# EAGLE design FED3_041319 (EAGLE 9.3.0)
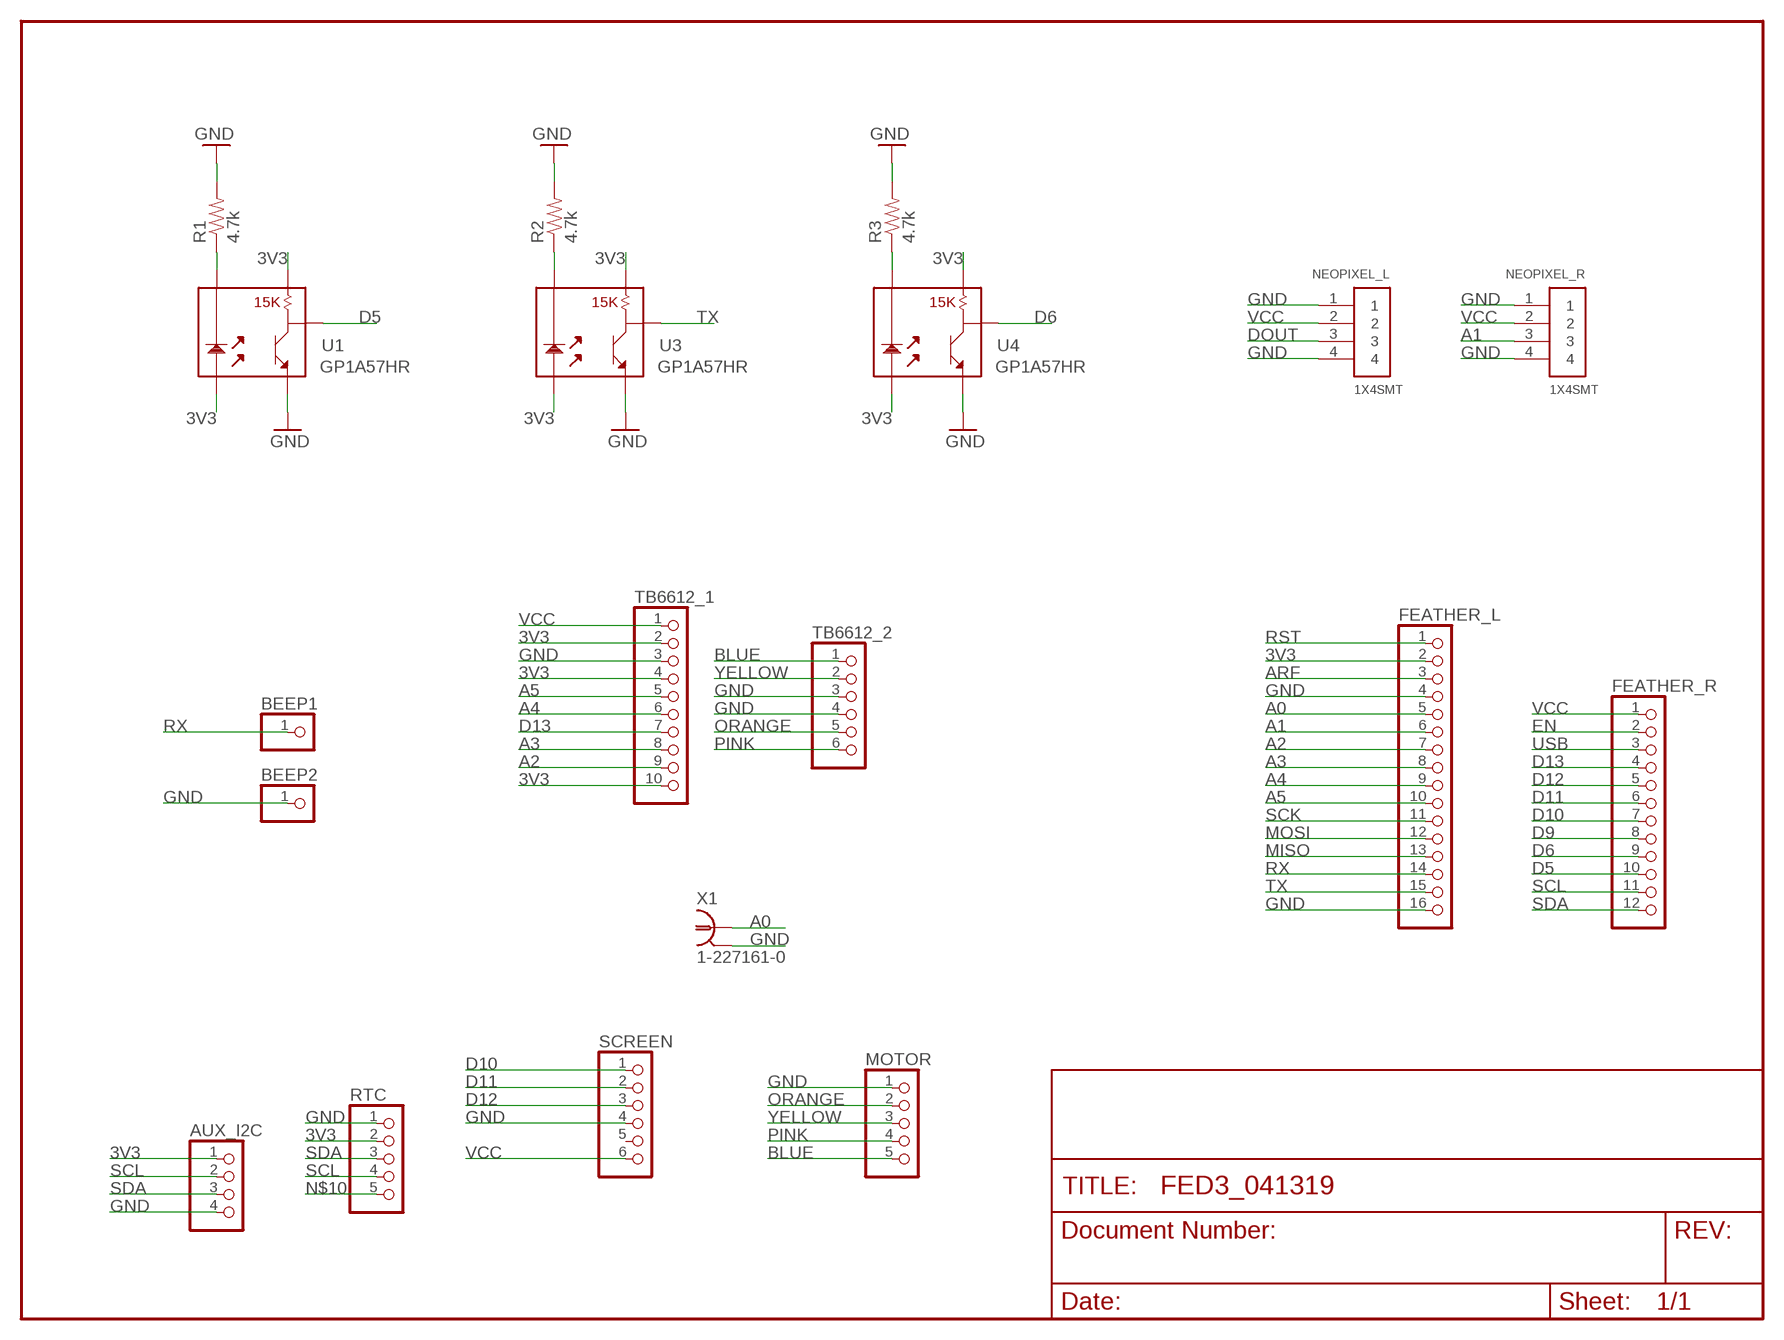
[diagram p0: schematic, sheet 1]

## Parts
AUX_I2C  PINHD-1X4  [1X04]
BEEP1  PINHD-1X1  [1X01]
BEEP2  PINHD-1X1  [1X01]
FEATHER_L  PINHD-1X16  [1X16]
FEATHER_R  PINHD-1X12  [1X12]
MOTOR  PINHD-1X5  [1X05]
NEOPIXEL_L  1X4SMT  [1X4-SMT]
NEOPIXEL_R  1X4SMT  [1X4-SMT]
R1  4.7k  RESISTORPTH1  [AXIAL-0.3]
R2  4.7k  RESISTORPTH1  [AXIAL-0.3]
R3  4.7k  RESISTORPTH1  [AXIAL-0.3]
RTC  PINHD-1X5  [1X05]
SCREEN  PINHD-1X6  [1X06]
TB6612_1  PINHD-1X10  [1X10]
TB6612_2  PINHD-1X6  [1X06]
U1  GP1A57HR  [GP1A57HR]
U3  GP1A57HR  [GP1A57HR]
U4  GP1A57HR  [GP1A57HR]
X1  1-227161-0  [AMP_227161]

## Nets
3V3: AUX_I2C.1 FEATHER_L.2 RTC.2 TB6612_1.2 TB6612_1.4 TB6612_1.10 U1.1 U1.3 U3.1 U3.3 U4.1 U4.3
A0: FEATHER_L.5 X1.1
A1: FEATHER_L.6 NEOPIXEL_R.3
A2: FEATHER_L.7 TB6612_1.9
A3: FEATHER_L.8 TB6612_1.8
A4: FEATHER_L.9 TB6612_1.6
A5: FEATHER_L.10 TB6612_1.5
ARF: FEATHER_L.3
BLUE: MOTOR.5 TB6612_2.1
D5: FEATHER_R.10 U1.4
D6: FEATHER_R.9 U4.4
D9: FEATHER_R.8
D10: FEATHER_R.7 SCREEN.1
D11: FEATHER_R.6 SCREEN.2
D12: FEATHER_R.5 SCREEN.3
D13: FEATHER_R.4 TB6612_1.7
DOUT: NEOPIXEL_L.3
EN: FEATHER_R.2
GND: AUX_I2C.4 BEEP2.1 FEATHER_L.4 FEATHER_L.16 MOTOR.1 NEOPIXEL_L.1 NEOPIXEL_L.4 NEOPIXEL_R.1 NEOPIXEL_R.4 R1.P$2 R2.P$2 R3.P$2 RTC.1 SCREEN.4 TB6612_1.3 TB6612_2.3 TB6612_2.4 U1.5 U3.5 U4.5 X1.2
MISO: FEATHER_L.13
MOSI: FEATHER_L.12
N$1: R2.P$1 U3.2
N$2: R1.P$1 U1.2
N$3: R3.P$1 U4.2
N$10: RTC.5
ORANGE: MOTOR.2 TB6612_2.5
PINK: MOTOR.4 TB6612_2.6
RST: FEATHER_L.1
RX: BEEP1.1 FEATHER_L.14
SCK: FEATHER_L.11
SCL: AUX_I2C.2 FEATHER_R.11 RTC.4
SDA: AUX_I2C.3 FEATHER_R.12 RTC.3
TX: FEATHER_L.15 U3.4
USB: FEATHER_R.3
VCC: FEATHER_R.1 NEOPIXEL_L.2 NEOPIXEL_R.2 SCREEN.6 TB6612_1.1
YELLOW: MOTOR.3 TB6612_2.2
Unconnected: SCREEN.5

## Library data of the parts
AUX_I2C = pinhead:PINHD-1X4: PIN HEADER
BEEP1 BEEP2 = pinhead:PINHD-1X1: PIN HEADER
FEATHER_L = pinhead:PINHD-1X16: PIN HEADER
FEATHER_R = pinhead:PINHD-1X12: PIN HEADER
MOTOR RTC = pinhead:PINHD-1X5: PIN HEADER
NEOPIXEL_L NEOPIXEL_R = adafruit:1X4: 4-pin connector
R1-R3 = SparkFun:RESISTOR: Resistor Basic schematic elements and footprints for 0603, 1206, and PTH 1/10th watt (small) resistors.
SCREEN TB6612_2 = pinhead:PINHD-1X6: PIN HEADER
TB6612_1 = pinhead:PINHD-1X10: PIN HEADER
U1 U3 U4 = SparkFun:GP1A57HR
X1 = con-coax:?227161*: JACK, RIGHT ANGLE, 50 OHM, PCB, BNC Source: amp_227161.pdf; MF: TYCO ELECTRONICS; MPN: 1-227161; OC_FARNELL: unknown; OC_NEWARK: 33B3200

## Board
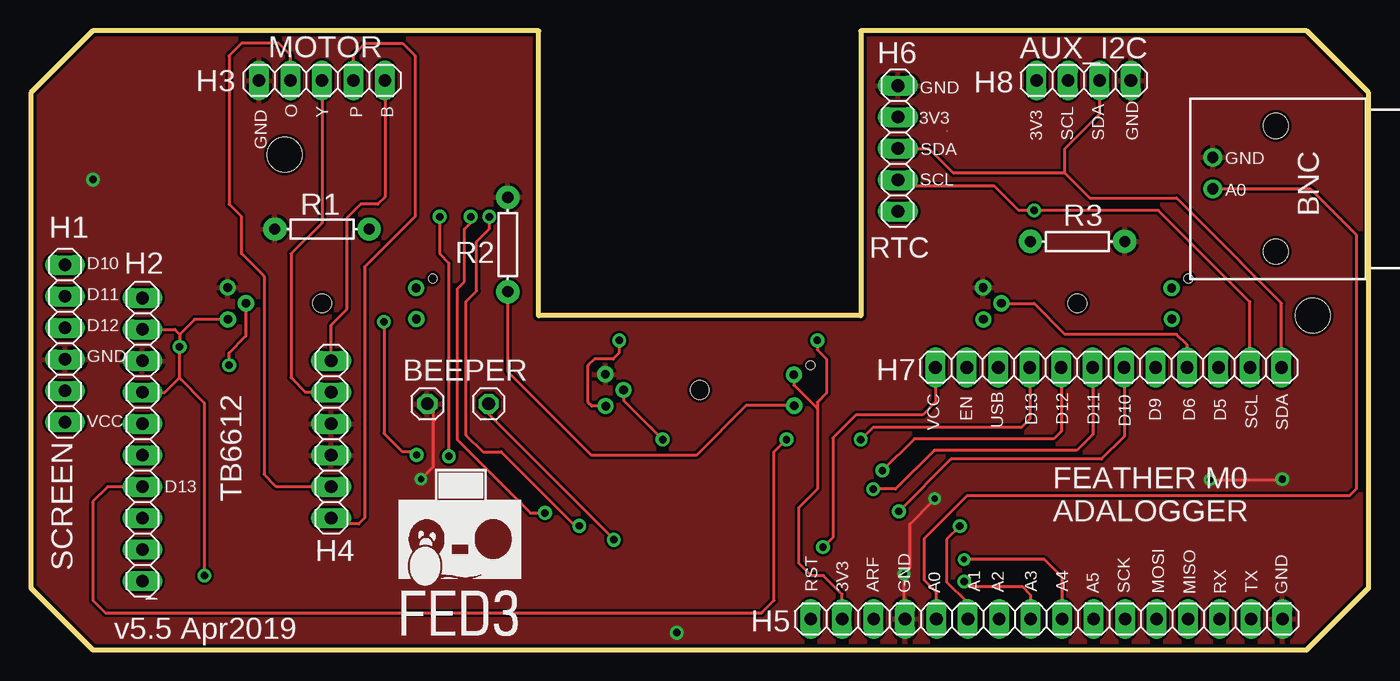
[diagram p1: board, top side]
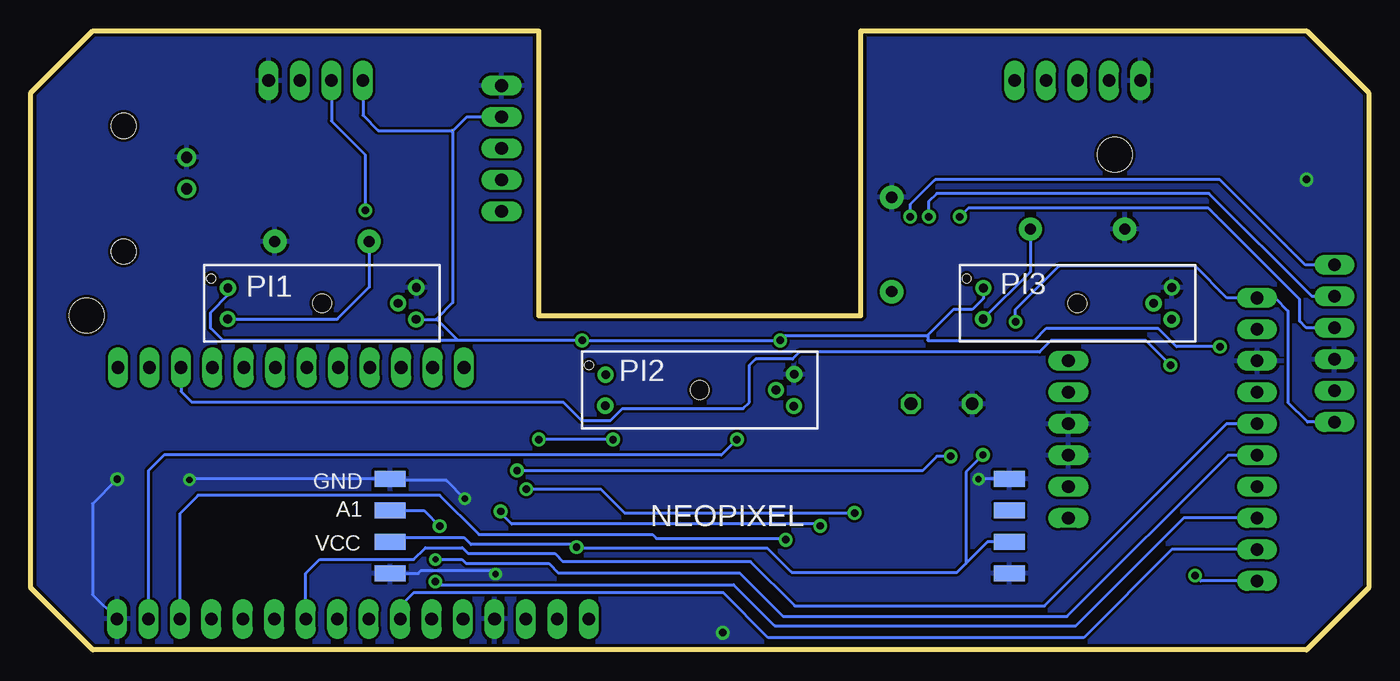
[diagram p2: board, bottom side, seen from below]

Size 108 x 50 mm. Coordinates in mm from the lower left corner, seen from the top.
Outline: 0,45 0,5 5,0 103,0 108,5 108,45 103,50 67,50 67,27 41,27 41,50 5,50 0,45
Copper layers (1*16): Top 0.0356mm / dielectric 1.5011mm / Bottom 0.0356mm
Design rules "default": minimum track width 8mil, minimum drill 20mil, track to track 8mil, track to pad 8mil, pad to pad 8mil, via to via 8mil, smd to smd 8mil, copper to edge 10mil, drill to drill 8mil, minimum pad ring 12mil, minimum via ring 10mil, stop-mask expansion 4mil, vias tented up to drill 20mil, thermal gap 10mil
Holes 2.8 mm at 20.5,40 103.5,27

### Footprints (pad centres in the part's own frame; a part is rotated, then mirrored left to right if it is on the bottom)
1X04 = drill 1.016 long: 1 -3.81,0; 2 -1.27,0; 3 1.27,0; 4 3.81,0
1X01 = drill 1.016 octagon: 1 0,0
1X16 = drill 1.016 long: 1 -19.05,0; 2 -16.51,0; 3 -13.97,0; 4 -11.43,0; 5 -8.89,0; 6 -6.35,0; 7 -3.81,0; 8 -1.27,0; 9 1.27,0; 10 3.81,0; 11 6.35,0; 12 8.89,0; 13 11.43,0; 14 13.97,0; 15 16.51,0; 16 19.05,0
1X12 = drill 1.016 long: 1 -13.97,0; 2 -11.43,0; 3 -8.89,0; 4 -6.35,0; 5 -3.81,0; 6 -1.27,0; 7 1.27,0; 8 3.81,0; 9 6.35,0; 10 8.89,0; 11 11.43,0; 12 13.97,0
1X05 = drill 1.016 long: 1 -5.08,0; 2 -2.54,0; 3 0,0; 4 2.54,0; 5 5.08,0
1X4-SMT = smd 1.27 x 2.54: 1 -3.81,0; 2 -1.27,0; 3 1.27,0; 4 3.81,0
AXIAL-0.3 = drill 0.9 pad 1.88: P$1 -3.81,0; P$2 3.81,0
1X06 = drill 1.016 long: 1 -6.35,0; 2 -3.81,0; 3 -1.27,0; 4 1.27,0; 5 3.81,0; 6 6.35,0
1X10 = drill 1.016 long: 1 -11.43,0; 2 -8.89,0; 3 -6.35,0; 4 -3.81,0; 5 -1.27,0; 6 1.27,0; 7 3.81,0; 8 6.35,0; 9 8.89,0; 10 11.43,0
GP1A57HR = drill 0.7: 1 -7.6,1.24; 2 -7.62,-1.27; 3 7.6,-1.3; 4 6.15,0; 5 7.62,1.27 | hole 1.5: 0,0 | hole 0.7: -8.95,2
AMP_227161 = drill 0.9 pad 1.27: 1 0,-5.08; 2 -2.54,-5.08 | hole 2: -5.08,0; 5.08,0

### Placement (x,y rotation side)
AUX_I2C  85,46 0 top
BEEP1  36.95,19.88 0 top
BEEP2  32,19.88 0 top
FEATHER_L  82,2.5 0 top
FEATHER_R  87,22.82 0 top
MOTOR  23.5,46 0 top
NEOPIXEL_L  29,10 90 bottom
NEOPIXEL_R  79,10 90 bottom
R1  23.5,34 180 top
R2  38.5,32.75 90 top
R3  84.5,33 0 top
RTC  70,40.5 270 top
SCREEN  2.75,24.75 270 top
TB6612_1  9,17 270 top
TB6612_2  24.24,17 270 top
U1  23.5,28 0 bottom
U3  54,21 0 bottom
U4  84.5,28 0 bottom
X1  100.5,37.25 270 top

### Tracks (layer width: path | path; a pad name or v marks a point on that pad's centre or on a via)
3V3  (via drill 0.6, 0.6 pad 0.61)  (1 unrouted)
  Top 0.254: 12,22 12,21.96 14,19.96 v14,6 | 12,22 v12,24.5 12,25.5 | v47.5,25 47.5,24 47,23.5 45.5,23.5 45,23 45,20 45.3,19.7 U3.3 | 63.5,19.5 63.5,20 64.25,20.75 64.25,23.5 63.5,24.25 v63.5,25 | 63.5,19.5 63.5,13 62,11.5 62,7 63,6 64,6 65.49,4.51 FEATHER_L.2 | TB6612_1.4 10.81,20.81 12,22 | TB6612_1.2 11.61,25.89 12,25.5 | U1.3 13.2,26.7 12,25.5 | U3.1 61.6,21.4 63.5,19.5
  Bottom 0.254: 35.62,25.38 47.12,25.38 v47.5,25 v63.5,25 73.5,25 | 35.62,25.38 35.59,25.38 35.59,25 27,25 26,26 17,26 15.5,24.5 v12,24.5 | 35.62,25.38 33.5,27.5 32,27.5 31.1,28.4 U1.1 | U4.1 92.1,28.65 93.5,27.25 93.5,26 92.5,25 73.5,25 | TB6612_1.10 13.57,5.57 v14,6 | 73.95,41.96 73.95,28.05 75.3,26.7 | 75.3,26.7 75.2,26.7 73.5,25 | U4.3 75.3,26.7 | AUX_I2C.1 81.19,43.19 79.96,41.96 74,41.96 74,41.86 72.82,43.04 RTC.2
A0
  Top 0.254: X1.1 103.3,37.25 107,33.55 107,13 106.48,12.48 75.63,12.48 72.12,8.98 72.12,5.65 73.11,4.66 FEATHER_L.5
A1  (via drill 0.6)
  Top 0.254: v75,10 73.93,8.93 73.93,5.51 75.65,3.79 FEATHER_L.6
  Bottom 0.254: NEOPIXEL_R.3 76.27,11.27 v75,10
A2
  Bottom 0.254: TB6612_1.9 15.89,8.11 23,1 48.48,1 52.1,4.62 71.81,4.62 77.1,4.62 78.03,3.68 78.26,3.68 78.26,2.57 FEATHER_L.7
A3  (via drill 0.6)
  Top 0.254: v75.35,5.52 75.78,5.09 80.08,5.09 80.73,4.43 FEATHER_L.8
  Bottom 0.203: v75.35,5.52 75.35,5.3 75.38,5.27
  Bottom 0.254: 75.38,5.27 51.27,5.27 47.96,1.96 23.62,1.96 14.93,10.65 TB6612_1.8
A4  (via drill 0.51)
  Top 0.254: FEATHER_L.9 83.27,5.86 81.81,7.32 v75.34,7.32
  Bottom 0.254: TB6612_1.6 11.33,15.73 24.35,2.71 47.28,2.71 50.8,6.23 65.42,6.23 66.18,6.99 72.86,6.99 73.19,7.32 v75.34,7.32
A5
  Bottom 0.254: TB6612_1.5 11.47,18.27 26.17,3.57 46.32,3.57 49.89,7.13 65.03,7.13 65.69,7.8 72.69,7.8 73.15,8.26 76.15,8.26 77.09,7.32 84.68,7.32 85.81,6.19 FEATHER_L.10
BLUE
  Top 0.254: MOTOR.5 28.58,36.58 28,36 26.64,36 25.5,34.87 25.5,27.5 24.24,26.24 TB6612_2.1
D5  (via drill 0.6)
  Top 0.254: v16,23 16,24 17.35,25.35 U1.4
  Bottom 0.254: v16,23 18,25 25.64,25 26.57,24.07 45.93,24.07 46.5,23.5 49.5,23.5 50,23 50,20 50.5,19.5 60.25,19.5 61.25,18.5 63.5,18.5 65,20 95,20 95.89,20.89 FEATHER_R.10
D6
  Top 0.254: U4.4 81,28 83.5,25.5 92.5,25.5 93.35,24.65 FEATHER_R.9
D10  (via drill 0.6)
  Top 0.254: v37,35 37,34 36,33 36,29 35.15,28.15 35.15,17.35 36.5,16 37.98,16 43.95,10.03 v44.27,10.03 | v70.08,11.2 74.3,15.41 86.44,15.41 88.27,17.24 FEATHER_R.7
  Bottom 0.254: v70.08,11.2 70.08,11.08 69.18,10.18 44.53,10.18 44.38,10.03 v44.27,10.03 | v37,35 37,36 35.01,37.99 11.99,37.99 5.1,31.1 SCREEN.1
D11  (via drill 0.6)
  Top 0.254: v68,13 69.81,13 72.94,16.13 84.44,16.13 85.73,17.42 FEATHER_R.6 | v35.5,35 35.5,34.5 35,34 35,29.76 34.43,29.19 34.43,16.98 40.34,11.07 v41.51,11.07
  Bottom 0.254: v68,13 62,13 60.07,11.07 v41.51,11.07 | v35.5,35 35.5,36.25 34.87,36.88 12.88,36.88 4.56,28.56 SCREEN.2
D12  (via drill 0.6)
  Top 0.254: FEATHER_R.5 83.19,17.66 82.59,17.07 71.31,17.07 v68.75,14.5 | v33,35 33,32 33.74,31.26 v33.74,15.64
  Bottom 0.254: v68.75,14.5 36,14.5 34.86,15.64 v33.74,15.64 | SCREEN.3 5.02,26.02 5.57,26.57 5.57,28.31 12.95,35.7 32.3,35.7 v33,35
D13  (via drill 0.6)
  Top 0.254: FEATHER_R.4 80.65,18.65 79.97,17.96 67.97,17.96 v67,17 | TB6612_1.7 6.19,13.19 5,12 5,4 6,3 59,3 60,4 60,16 v61,17
  Bottom 0.254: v61,17 v67,17
GND  (via drill 0.51, 0.6 pad 0.81)
  Top 0.203: v70.48,6.13 70.61,6.26
  Top 0.254: v31.5,13.79 32.48,14.78 32.48,19.4 BEEP2.1 | FEATHER_L.4 70.57,3.47 70.48,3.56 v70.48,6.13 70.97,6.62 70.97,10.16 72.92,12.12 73,12.12 72.97,12.14 v72.97,12.22 | v95.2,13.74 100.98,13.74 v101.03,13.8
  Bottom 0.203: NEOPIXEL_R.4 78.79,14.02
  Bottom 0.254: NEOPIXEL_R.4 78.86,13.95 | NEOPIXEL_R.4 78.98,13.79 | NEOPIXEL_L.4 31.4,13.81 31.5,13.72 v31.5,13.79 | NEOPIXEL_R.1 76.74,6.19 76.5,6.43 70.78,6.43 v70.48,6.13 | NEOPIXEL_R.4 95.01,13.81 95.07,13.87 v95.2,13.74 | v101.03,13.8 103.02,11.82 103.02,4.47 FEATHER_L.16 | v72.97,12.22 74.45,13.69 78,13.69
  other vias: 52.15,1.39 5,38
  pour Bottom: 0,5 5,0 103,0 108,5 108,45 103,50 67,50 67,27 41,27 41,50 5,50 0,45
  pour Top: 0,5 5,0 106.78,0 109.32,2.54 109.32,43.68 103,50 67,50 67,27 41,27 41,50 5,50 0,45
N$1
  Top 0.254: U3.2 57.73,19.73 53.72,15.72 45.28,15.72 38.5,22.5 R2.P$1
N$2
  Bottom 0.254: R1.P$1 27.31,30.54 U1.2
N$3
  Bottom 0.254: U4.2 83.27,26.73 80.69,29.31 R3.P$1
ORANGE
  Top 0.254: TB6612_2.5 19.81,13.19 18.81,14.19 18.81,30.19 17,32 17,35 16,36 16,48 17,49 20,49 20.96,48.04 MOTOR.2
PINK
  Top 0.254: MOTOR.4 26.04,48.04 27,49 30,49 31,48 31,35 26.93,30.93 26.93,10.65 26.47,10.19 24.7,10.19 TB6612_2.6
RX  (via drill 0.6)
  Top 0.254: v47.06,8.9 47.06,8.95 36.95,19.07 BEEP1.1
  Bottom 0.254: v47.06,8.9 47.17,9 57.5,9 57.83,9.33 71.83,9.33 75,12.5 94.5,12.5 95.97,11.03 FEATHER_L.14
SCL  (via drill 0.6)
  Top 0.254: FEATHER_R.11 98.43,28.12 91.05,35.5 v81,35.5 79.75,35.5 77.8,37.45 70.51,37.45 RTC.4
  Bottom 0.254: AUX_I2C.2 83.73,42.73 81,40 v81,35.5
SDA
  Top 0.254: 83.5,38.5 83.5,40.5 86.27,43.27 AUX_I2C.3 | FEATHER_R.12 100.97,28.01 97.68,31.3 97.68,31.34 92.52,36.5 85.5,36.5 83.5,38.5 | 83.5,38.5 74.5,38.5 72.5,40.5 RTC.3
TX  (via drill 0.6)
  Top 0.254: U3.4 47.85,20.15 v51,17
  Bottom 0.254: v51,17 52.25,15.75 97.25,15.75 98.51,14.49 FEATHER_L.15
VCC  (via drill 0.6)
  Top 0.254: v28.5,26.5 28.5,17.5 30,16 31,16 31.14,15.86 v31.14,15.75 | FEATHER_R.1 73.03,20.03 72,19 66.63,19 64.74,17.11 64.74,9.09 v63.95,8.3
  Bottom 0.254: NEOPIXEL_R.2 78.64,9.09 73.04,9.09 72.48,8.52 64.21,8.52 63.99,8.3 v63.95,8.3 63.88,8.24 48.56,8.24 46.59,6.27 33.23,6.27 32.51,6.99 | NEOPIXEL_L.2 30.77,8.73 32.51,6.99 | v28.5,26.5 28.5,27.5 25,31 14,31 11.43,28.43 TB6612_1.1 7.54,28.43 6.5,27.39 6.5,19.98 4.92,18.4 SCREEN.6 | v31.14,15.75 32.51,14.38 32.51,6.99
YELLOW
  Top 0.254: MOTOR.3 23.5,34.5 21,32 21,22 22.19,20.81 TB6612_2.2

### Text on the board
tNames: H6 | H3 | GND | H8 | GND | O | Y | P | B | 3V3 | 3V3 | SCL | SDA | GND | SDA | GND | SCL | A0 | R1 | BNC | R3 | H1 | D10 | R2 | H2 | D11 | D12 | GND | BEEPER | H7 | VCC | VCC | EN | USB | D13 | D12 | D11 | D10 | D9 | D6 | D5 | SCL | SDA | D13 | TB6612 | FEATHER M0 / ADALOGGER | H4 | RST | 3V3 | ARF | GND | A0 | A1 | A2 | A3 | A4 | A5 | SCK | MOSI | MISO | RX | TX | GND | v5.5 Apr2019 | H5
bNames: PI3 | PI1 | PI2 | GND | A1 | NEOPIXEL | VCC